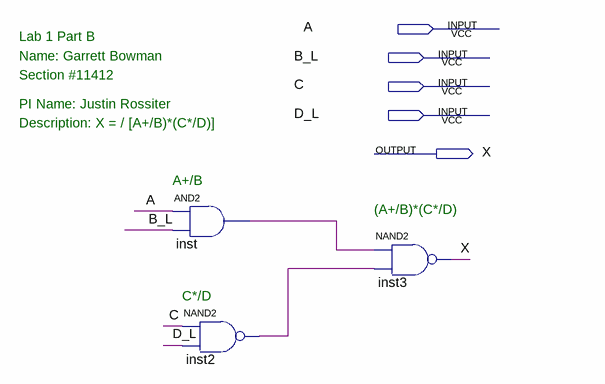
[diagram p0: schematic sheet]
// Quartus schematic Lab1b.bdf as structural Verilog: 3 symbols, 5 pins
module Lab1b (
  input  A,
  input  B_L,
  input  C,
  input  D_L,
  output X
);

  wire inst2_out, inst_out;

  and inst (inst_out, A, B_L);
  nand inst2 (inst2_out, C, D_L);
  nand inst3 (X, inst_out, inst2_out);

  // Notes on the sheet:
  //   Lab 1 Part B
  //   Name: Garrett Bowman
  //   Section #11412
  //   PI Name: Justin Rossiter
  //   Description: X = / [A+/B)*(C*/D)]
  //   A+/B
  //   (A+/B)*(C*/D)
  //   C*/D
endmodule
